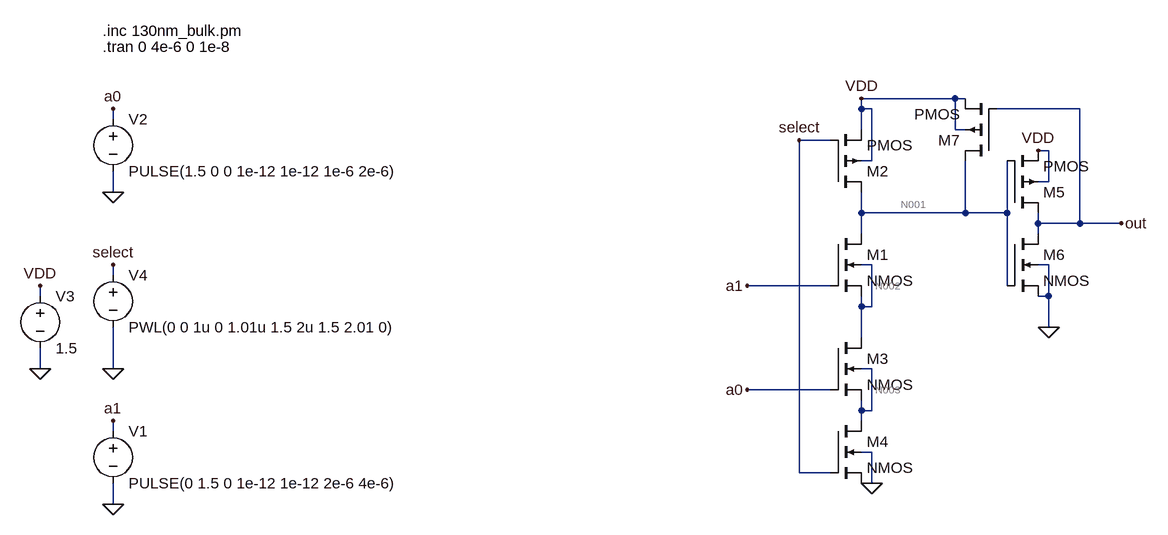
[diagram p0: schematic Charge_dec.asc]
Charge_dec.asc, the LTspice schematic file:
Version 4
SHEET 1 888 680
WIRE 576 -192 432 -192
WIRE 592 -192 576 -192
WIRE 432 -176 432 -192
WIRE 448 -176 432 -176
WIRE 768 -176 640 -176
WIRE -720 -160 -720 -176
WIRE 432 -144 432 -176
WIRE 576 -144 576 -192
WIRE 592 -144 576 -144
WIRE 384 -128 336 -128
WIRE 720 -112 704 -112
WIRE 448 -96 448 -176
WIRE 448 -96 432 -96
WIRE 720 -64 720 -112
WIRE 720 -64 704 -64
WIRE -720 -48 -720 -80
WIRE 432 -16 432 -48
WIRE 592 -16 592 -96
WIRE 592 -16 432 -16
WIRE 656 -16 656 -96
WIRE 656 -16 592 -16
WIRE 704 0 704 -16
WIRE 768 0 768 -176
WIRE 768 0 704 0
WIRE 832 0 768 0
WIRE 432 16 432 -16
WIRE 704 16 704 0
WIRE 448 64 432 64
WIRE 720 64 704 64
WIRE -720 80 -720 64
WIRE 384 96 256 96
WIRE 656 96 656 -16
WIRE -832 112 -832 96
WIRE 720 112 720 64
WIRE 720 112 704 112
WIRE 432 128 432 112
WIRE 448 128 448 64
WIRE 448 128 432 128
WIRE 720 160 720 112
WIRE 432 176 432 128
WIRE -832 224 -832 192
WIRE -720 224 -720 160
WIRE 448 224 432 224
WIRE 384 256 256 256
WIRE 432 288 432 272
WIRE 448 288 448 224
WIRE 448 288 432 288
WIRE 432 304 432 288
WIRE -720 320 -720 304
WIRE 448 352 432 352
WIRE 336 384 336 -128
WIRE 384 384 336 384
WIRE 448 400 448 352
WIRE 448 400 432 400
WIRE -720 432 -720 400
FLAG 448 400 0
FLAG 432 -192 VDD
FLAG 720 160 0
FLAG 256 96 a1
FLAG 256 256 a0
FLAG 832 0 out
FLAG -720 -48 0
FLAG -720 432 0
FLAG -720 304 a1
FLAG -720 -176 a0
FLAG -832 224 0
FLAG -832 96 VDD
FLAG -720 224 0
FLAG -720 64 select
FLAG 336 -128 select
FLAG 704 -112 VDD
SYMBOL nmos4 384 16 R0
SYMATTR InstName M1
SYMATTR Value2 l=130e-9 w=1300e-9 ad=676000e-18 as=676000e-18 pd=3640e-9 ps=3640e-9
SYMBOL pmos4 384 -48 M180
SYMATTR InstName M2
SYMATTR Value2 l=130e-9 w=2600e-9 ad=676000e-18 as=676000e-18 pd=3640e-9 ps=3640e-9
SYMBOL nmos4 384 176 R0
SYMATTR InstName M3
SYMATTR Value2 l=130e-9 w=1300e-9 ad=676000e-18 as=676000e-18 pd=3640e-9 ps=3640e-9
SYMBOL nmos4 384 304 R0
SYMATTR InstName M4
SYMATTR Value2 l=130e-9 w=1300e-9 ad=676000e-18 as=676000e-18 pd=3640e-9 ps=3640e-9
SYMBOL pmos4 656 -16 M180
SYMATTR InstName M5
SYMATTR Value2 l=130e-9 w=2600e-9 ad=676000e-18 as=676000e-18 pd=3640e-9 ps=3640e-9
SYMBOL nmos4 656 16 R0
SYMATTR InstName M6
SYMATTR Value2 l=130e-9 w=1300e-9 ad=676000e-18 as=676000e-18 pd=3640e-9 ps=3640e-9
SYMBOL pmos4 640 -96 R180
SYMATTR InstName M7
SYMATTR Value2 l=260e-9 w=2600e-9 ad=676000e-18 as=676000e-18 pd=3640e-9 ps=3640e-9
SYMBOL voltage -720 304 R0
WINDOW 123 0 0 Left 0
WINDOW 39 0 0 Left 0
SYMATTR InstName V1
SYMATTR Value PULSE(0 1.5 0 1e-12 1e-12 2e-6 4e-6)
SYMBOL voltage -720 -176 R0
WINDOW 123 0 0 Left 0
WINDOW 39 0 0 Left 0
SYMATTR InstName V2
SYMATTR Value PULSE(1.5 0 0 1e-12 1e-12 1e-6 2e-6)
SYMBOL voltage -832 96 R0
WINDOW 123 0 0 Left 0
WINDOW 39 0 0 Left 0
SYMATTR InstName V3
SYMATTR Value 1.5
SYMBOL voltage -720 64 R0
WINDOW 123 0 0 Left 0
WINDOW 39 0 0 Left 0
SYMATTR InstName V4
SYMATTR Value PWL(0 0 1u 0 1.01u 1.5 2u 1.5 2.01 0)
TEXT -736 -296 Left 2 !.inc 130nm_bulk.pm
TEXT -736 -272 Left 2 !.tran 0 4e-6 0 1e-8

The netlist it stands for:
* Charge_dec.asc
M1 N001 a1 N002 N002 NMOS l=130e-9 w=1300e-9 ad=676000e-18 as=676000e-18 pd=3640e-9 ps=3640e-9
M2 N001 select VDD VDD PMOS l=130e-9 w=2600e-9 ad=676000e-18 as=676000e-18 pd=3640e-9 ps=3640e-9
M3 N002 a0 N003 N003 NMOS l=130e-9 w=1300e-9 ad=676000e-18 as=676000e-18 pd=3640e-9 ps=3640e-9
M4 N003 select 0 0 NMOS l=130e-9 w=1300e-9 ad=676000e-18 as=676000e-18 pd=3640e-9 ps=3640e-9
M5 out N001 VDD VDD PMOS l=130e-9 w=2600e-9 ad=676000e-18 as=676000e-18 pd=3640e-9 ps=3640e-9
M6 out N001 0 0 NMOS l=130e-9 w=1300e-9 ad=676000e-18 as=676000e-18 pd=3640e-9 ps=3640e-9
M7 N001 out VDD VDD PMOS l=260e-9 w=2600e-9 ad=676000e-18 as=676000e-18 pd=3640e-9 ps=3640e-9
V1 a1 0 PULSE(0 1.5 0 1e-12 1e-12 2e-6 4e-6)
V2 a0 0 PULSE(1.5 0 0 1e-12 1e-12 1e-6 2e-6)
V3 VDD 0 1.5
V4 select 0 PWL(0 0 1u 0 1.01u 1.5 2u 1.5 2.01 0)
.model NMOS NMOS
.model PMOS PMOS
.lib standard.mos
.inc 130nm_bulk.pm
.tran 0 4e-6 0 1e-8
.backanno
.end

* Results of the author's LTspice run, read from the files saved beside the schematic
* Operating Point, zero values left out:
*   V(n001) = 1.5 V
*   V(n002) = 296.6 mV
*   V(vdd) = 1.5 V
*   V(a0) = 1.5 V
*   V(n003) = 296.6 mV
*   V(out) = 24.55 µV
*   Id(M7) = -8.445 nA
*   Ig(M7) = -344.2 pA
*   Ib(M7) = 298.9 pA
*   Is(M7) = 8.49 nA
*   Id(M5) = -93.17 nA
*   Ig(M5) = 22.65 pA
*   Ib(M5) = 257.9 pA
*   Is(M5) = 92.89 nA
*   Id(M2) = -25.3 nA
*   Ig(M2) = -126.7 pA
*   Ib(M2) = 81.35 pA
*   Is(M2) = 25.35 nA
*   Id(M6) = 93.51 nA
*   Ig(M6) = 27.7 nA
*   Ib(M6) = -30.8 pA
*   Is(M6) = -121.2 nA
*   Id(M4) = 4.54 nA
*   Is(M4) = -4.538 nA
*   Id(M3) = 51.09 pA
*   Ig(M3) = 4.489 nA
*   Is(M3) = -4.539 nA
*   Id(M1) = 6.019 nA
*   Ig(M1) = -5.968 nA
*   Ib(M1) = -44.47 pA
*   Is(M1) = -6.619 pA
*   I(V4) = 127.5 pA
*   I(V3) = -127.4 nA
*   I(V2) = -4.489 nA
*   I(V1) = 5.968 nA
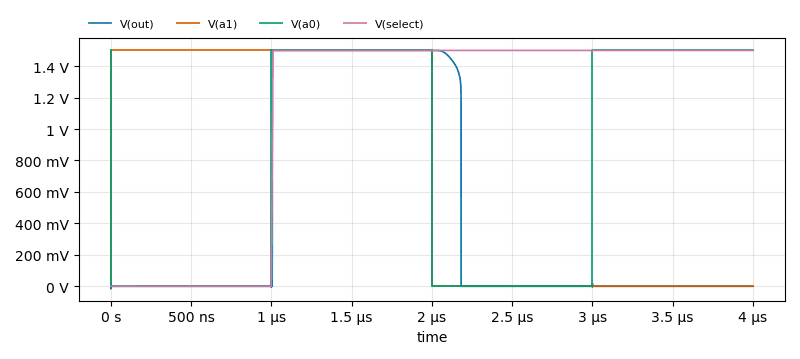
[diagram p1: Transient Analysis of Charge_dec.asc, plotted from the saved traces]
* Transient Analysis, 1 run:
*   V(out): min -15.89 mV, max 1.5 V, average 438.9 mV, rms 809.5 mV, last 24.67 µV
*   V(a1): min 0 V, max 1.5 V, average 750 mV, rms 1.061 V, last 0 V
*   V(a0): min 0 V, max 1.5 V, average 750 mV, rms 1.061 V, last 1.5 V
*   V(select): min 0 V, max 1.5 V, average 1.123 V, rms 1.298 V, last 1.5 V